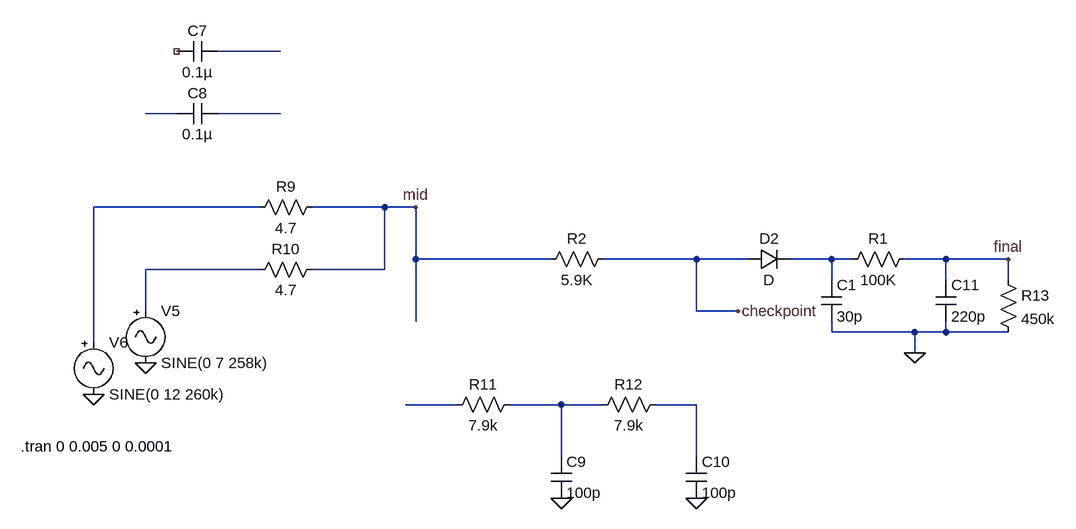
[diagram p0: schematic improvedHomeBuildMixer2.asc]
improvedHomeBuildMixer2.asc, the LTspice schematic file:
Version 4
SHEET 1 992 1124
WIRE -1760 240 -1856 240
WIRE -1920 336 -1968 336
WIRE -1760 336 -1856 336
WIRE -1792 480 -2048 480
WIRE -1600 480 -1712 480
WIRE -1552 480 -1600 480
WIRE -1552 560 -1552 480
WIRE -1344 560 -1552 560
WIRE -1120 560 -1264 560
WIRE -1040 560 -1120 560
WIRE -912 560 -976 560
WIRE -880 560 -912 560
WIRE -736 560 -800 560
WIRE -640 560 -736 560
WIRE -1792 576 -1968 576
WIRE -1600 576 -1600 480
WIRE -1600 576 -1712 576
WIRE -912 592 -912 560
WIRE -736 592 -736 560
WIRE -640 592 -640 560
WIRE -1968 640 -1968 576
WIRE -1120 640 -1120 560
WIRE -1056 640 -1120 640
WIRE -1552 656 -1552 560
WIRE -912 672 -912 656
WIRE -784 672 -912 672
WIRE -736 672 -736 656
WIRE -736 672 -784 672
WIRE -640 672 -736 672
WIRE -2048 688 -2048 480
WIRE -784 704 -784 672
WIRE -1488 784 -1568 784
WIRE -1328 784 -1408 784
WIRE -1264 784 -1328 784
WIRE -1120 784 -1184 784
WIRE -1328 864 -1328 784
WIRE -1120 864 -1120 784
FLAG -1968 720 0
FLAG -2048 768 0
FLAG -1552 480 mid
FLAG -1328 928 0
FLAG -1120 928 0
FLAG -1056 640 checkpoint
FLAG -784 704 0
FLAG -640 560 final
SYMBOL res -1696 464 R90
WINDOW 0 0 56 VBottom 2
WINDOW 3 32 56 VTop 2
SYMATTR InstName R9
SYMATTR Value 4.7
SYMBOL res -1696 560 R90
WINDOW 0 0 56 VBottom 2
WINDOW 3 32 56 VTop 2
SYMATTR InstName R10
SYMATTR Value 4.7
SYMBOL cap -1856 224 R90
WINDOW 0 0 32 VBottom 2
WINDOW 3 32 32 VTop 2
SYMATTR InstName C7
SYMATTR Value 0.1µ
SYMBOL cap -1856 320 R90
WINDOW 0 0 32 VBottom 2
WINDOW 3 32 32 VTop 2
SYMATTR InstName C8
SYMATTR Value 0.1µ
SYMBOL Misc\\signal -1968 624 R0
WINDOW 123 0 0 Left 0
WINDOW 39 0 0 Left 0
SYMATTR InstName V5
SYMATTR Value SINE(0 7 258k)
SYMBOL Misc\\signal -2048 672 R0
WINDOW 123 0 0 Left 0
WINDOW 39 0 0 Left 0
SYMATTR InstName V6
SYMATTR Value SINE(0 12 260k)
SYMBOL cap -1344 864 R0
SYMATTR InstName C9
SYMATTR Value 100p
SYMBOL cap -1136 864 R0
SYMATTR InstName C10
SYMATTR Value 100p
SYMBOL res -1392 768 R90
WINDOW 0 0 56 VBottom 2
WINDOW 3 32 56 VTop 2
SYMATTR InstName R11
SYMATTR Value 7.9k
SYMBOL res -1168 768 R90
WINDOW 0 0 56 VBottom 2
WINDOW 3 32 56 VTop 2
SYMATTR InstName R12
SYMATTR Value 7.9k
SYMBOL diode -1040 576 R270
WINDOW 0 32 32 VTop 2
WINDOW 3 0 32 VBottom 2
SYMATTR InstName D2
SYMBOL cap -752 592 R0
SYMATTR InstName C11
SYMATTR Value 220p
SYMBOL res -656 576 R0
SYMATTR InstName R13
SYMATTR Value 450k
SYMBOL res -1248 544 R90
WINDOW 0 0 56 VBottom 2
WINDOW 3 32 56 VTop 2
SYMATTR InstName R2
SYMATTR Value 5.9K
SYMBOL res -784 544 R90
WINDOW 0 0 56 VBottom 2
WINDOW 3 32 56 VTop 2
SYMATTR InstName R1
SYMATTR Value 100K
SYMBOL cap -928 592 R0
SYMATTR InstName C1
SYMATTR Value 30p
TEXT -2160 848 Left 2 !.tran 0 0.005 0 0.0001

The netlist it stands for:
* improvedHomeBuildMixer2.asc
R9 mid N004 4.7
R10 mid N006 4.7
C7 N001 NC_01 0.1µ
C8 N003 N002 0.1µ
V5 N006 0 SINE(0 7 258k)
V6 N004 0 SINE(0 12 260k)
C9 N008 0 100p
C10 N009 0 100p
R11 N008 N007 7.9k
R12 N009 N008 7.9k
D2 checkpoint N005 D
C11 final 0 220p
R13 final 0 450k
R2 checkpoint mid 5.9K
R1 final N005 100K
C1 N005 0 30p
.model D D
.lib standard.dio
.tran 0 0.005 0 0.0001
.backanno
.end